# EAGLE design Aux_kicker (EAGLE 6.1)
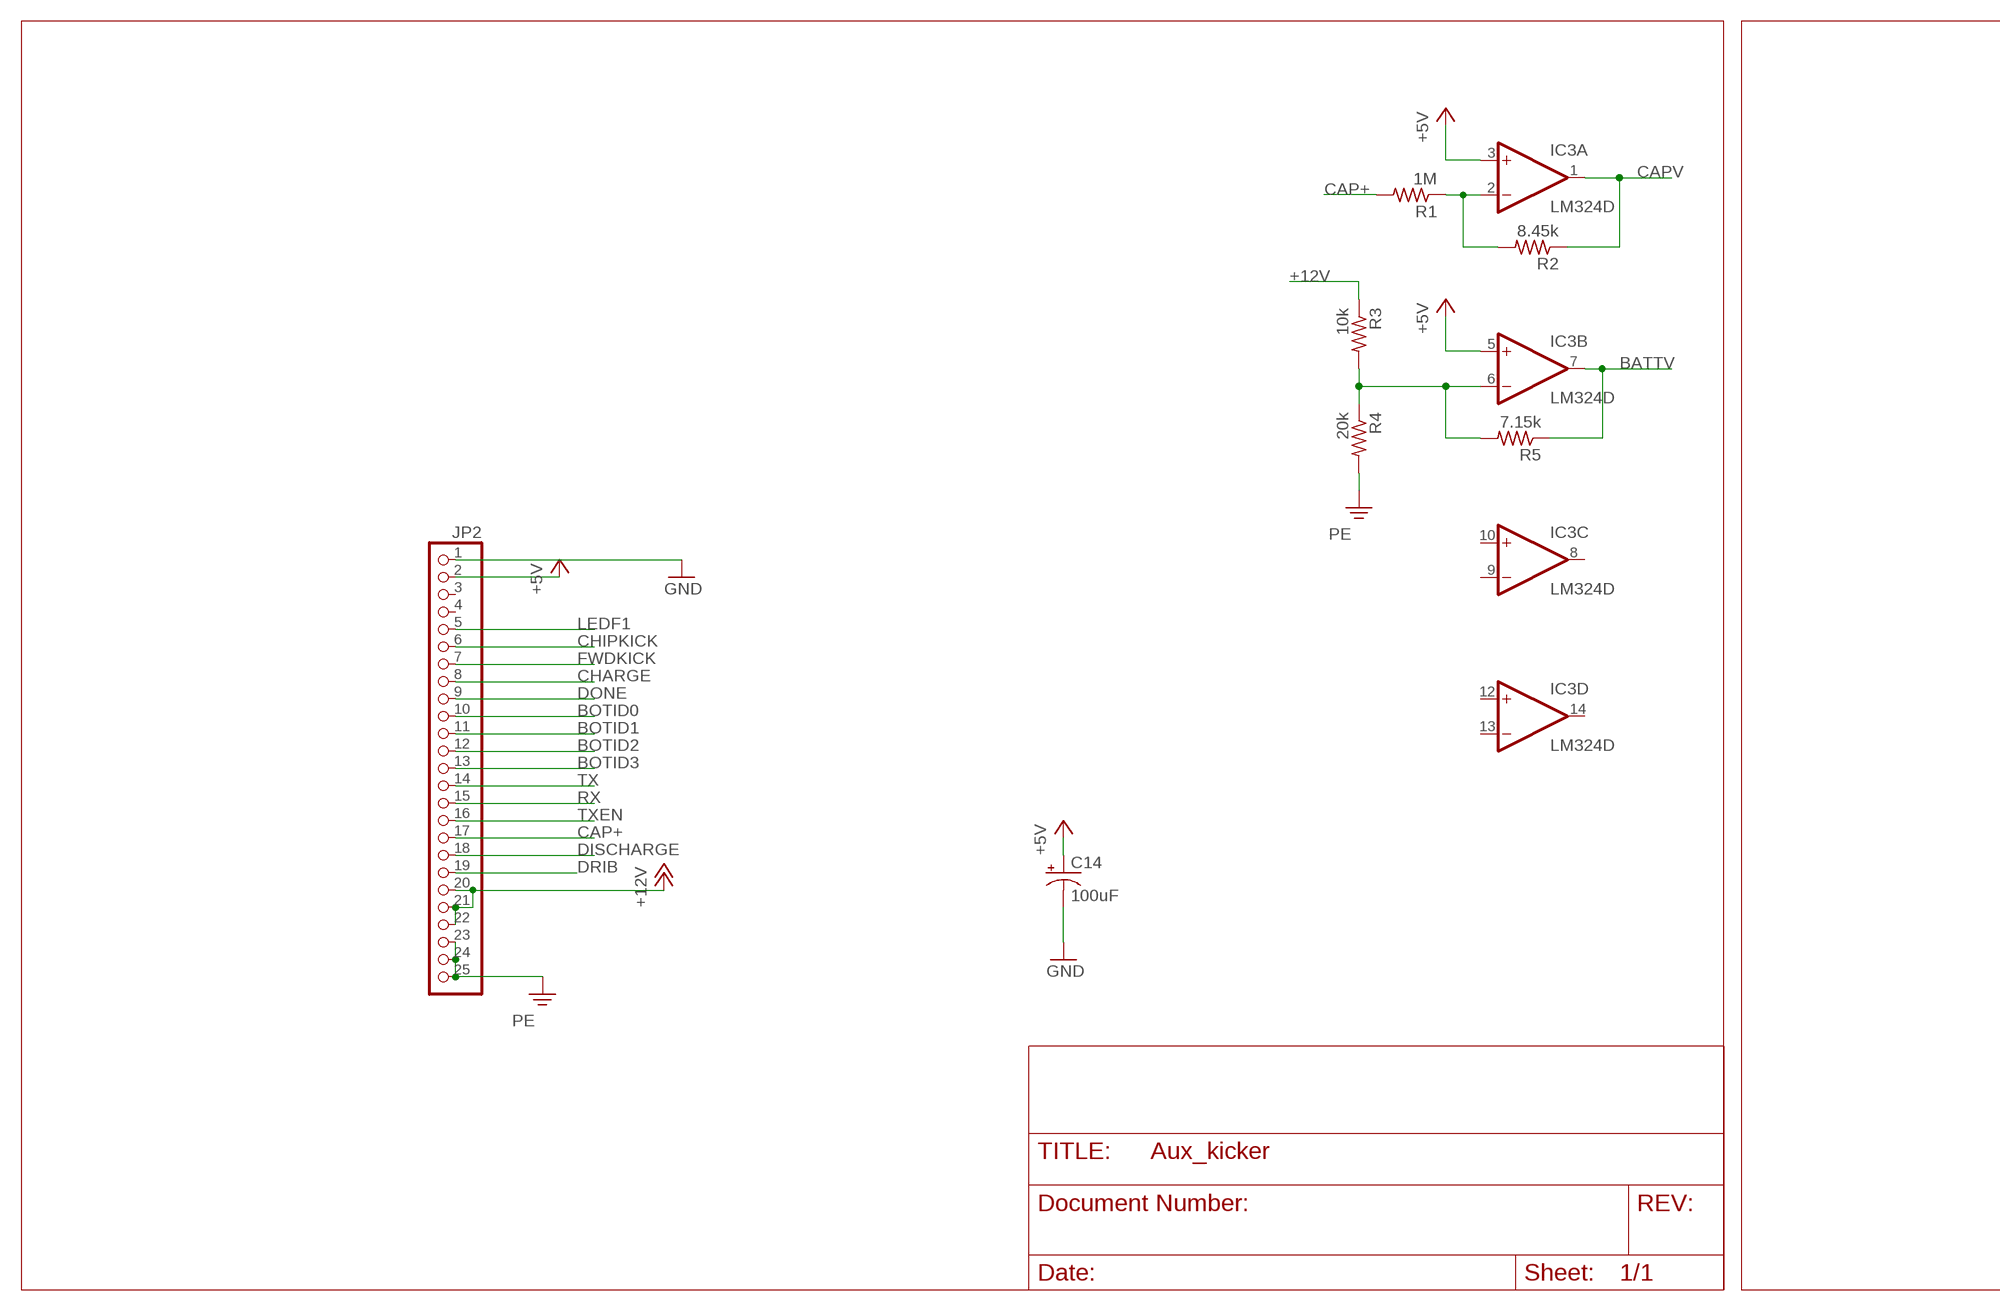
[diagram p0: schematic, sheet 1, part 1 of 2]
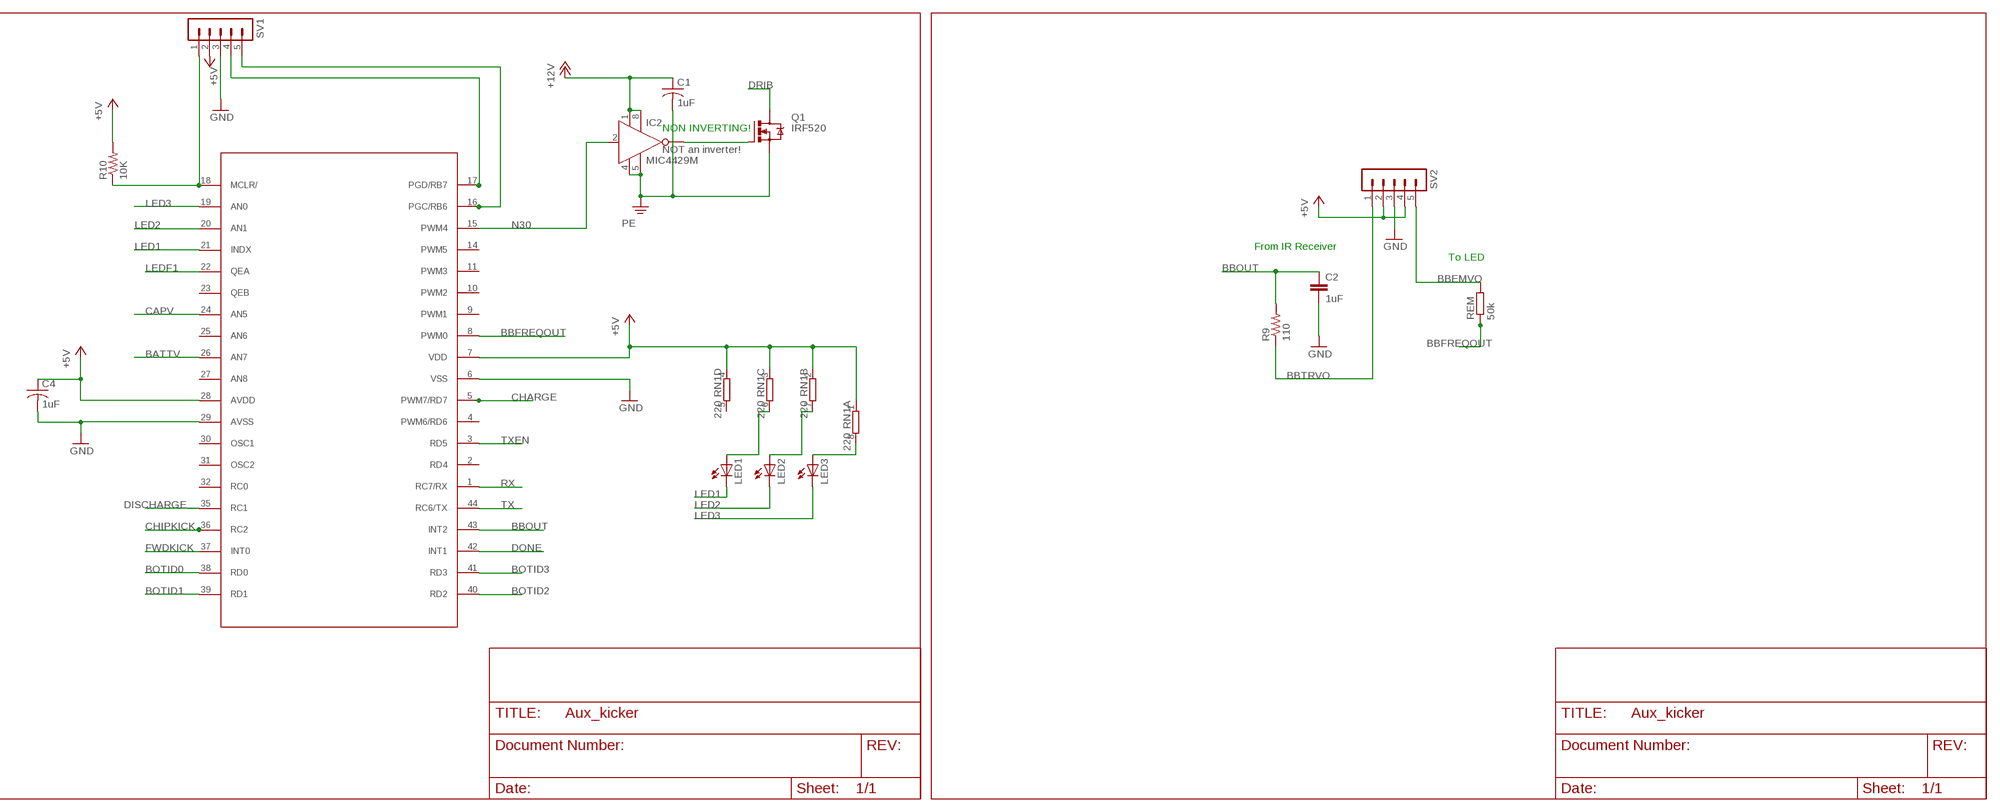
[diagram p1: schematic, sheet 1, part 2 of 2]

## Parts
C1  1uF  C-USC0805  [C0805]
C2  1uF  C-EUC0805  [C0805]
C4  1uF  C-USC0805  [C0805]
C14  100uF  CPOL-USE2.5-5  [E2,5-5]
IC1  PIC18F4431S  [TQFP44]
IC2  MIC4429M  [SO-08]
IC3  LM324D  [SO14]
JP2  PINHD-1X25  [1X25]
LED1  LEDCHIPLED_0805  [CHIPLED_0805]
LED2  LEDCHIPLED_0805  [CHIPLED_0805]
LED3  LEDCHIPLED_0805  [CHIPLED_0805]
Q1  IRF520  [TO220BV]
R1  1M  R-US_R0805  [R0805]
R2  8.45k  R-US_R0805  [R0805]
R3  10k  R-US_R0805  [R0805]
R4  20k  R-US_R0805  [R0805]
R5  7.15k  R-US_R0805  [R0805]
R9  110  R-US_R0805  [R0805]
R10  10K  R-US_R0805  [R0805]
REM  50k  R-EU_R0805  [R0805]
RN1  220  4R-N0603-ARC  [0603-ARC]
SV1  MA05-1  [MA05-1]
SV2  MA05-1  [MA05-1]

## Nets
+5V: C4.1 C14.+ IC1.7(VDD) IC1.28(AVDD) IC3.3(A:+IN) IC3.5(B:+IN) JP2.2 R10.2 RN1.1 RN1.2 RN1.3 RN1.4 SV1.2 SV2.2 SV2.4
+12V: C1.1 IC2.1(VS) IC2.8(VS1) JP2.20 JP2.21 JP2.22 R3.1
BATTV: IC1.26(AN7) IC3.7(B:OUT) R5.1
BBEMVO: REM.2 SV2.5
BBFREQOUT: IC1.8(PWM0) REM.1
BBOUT: C2.1 IC1.43(INT2) R9.2
BBTRVO: R9.1 SV2.1
BOTID0: IC1.38(RD0) JP2.10
BOTID1: IC1.39(RD1) JP2.11
BOTID2: IC1.40(RD2) JP2.12
BOTID3: IC1.41(RD3) JP2.13
CAP+: JP2.17 R1.2
CAPV: IC1.24(AN5) IC3.1(A:OUT) R2.1
CHARGE: IC1.5(PWM7/RD7) JP2.8
CHIPKICK: IC1.36(RC2) JP2.6
DISCHARGE: IC1.35(RC1) JP2.18
DONE: IC1.42(INT1) JP2.9
DRIB: JP2.19 Q1.D
FWDKICK: IC1.37(INT0) JP2.7
GND: C2.2 C4.2 C14.- IC1.6(VSS) IC1.29(AVSS) JP2.1 SV1.3 SV2.3
LED1: IC1.21(INDX) LED1.C
LED2: IC1.20(AN1) LED2.C
LED3: IC1.19(AN0) LED3.C
LEDF1: IC1.22(QEA) JP2.5
N30: IC1.15(PWM4) IC2.2(IN)
N$1: LED3.A RN1.8
N$2: LED2.A RN1.7
N$3: LED1.A RN1.6
N$4: IC3.2(A:-IN) R1.1 R2.2
N$5: IC2.6(OUT) Q1.G
N$7: IC3.6(B:-IN) R3.2 R4.1 R5.2
N$9: IC1.18(MCLR/) R10.1 SV1.1
N$22: IC1.17(PGD/RB7) SV1.4
N$23: IC1.16(PGC/RB6) SV1.5
PE: C1.2 IC2.4(GND) IC2.5(GND1) JP2.23 JP2.24 JP2.25 Q1.S R4.2
RX: IC1.1(RC7/RX) JP2.15
TX: IC1.44(RC6/TX) JP2.14
TXEN: IC1.3(RD5) JP2.16
Unconnected: IC1.2(RD4) IC1.4(PWM6/RD6) IC1.9(PWM1) IC1.10(PWM2) IC1.11(PWM3) IC1.14(PWM5) IC1.23(QEB) IC1.25(AN6) IC1.27(AN8) IC1.30(OSC1) IC1.31(OSC2) IC1.32(RC0) IC2.7(OUT) IC3.8(C:OUT) IC3.9(C:-IN) IC3.10(C:+IN) IC3.12(D:+IN) IC3.13(D:-IN) IC3.14(D:OUT) JP2.3 JP2.4 RN1.5

## Notes on the sheet
- NON INVERTING!
- NOT an inverter!
- From IR Receiver
- To LED

## Power pins joined to a net without a drawn wire
V+: IC3.4(P:V+)
V-: IC3.11(P:V-)

## Library data of the parts
C1 C4 = rcl:C-US: CAPACITOR, American symbol
C2 = rcl:C-EU: CAPACITOR, European symbol
C14 = rcl:CPOL-US: POLARIZED CAPACITOR, American symbol
IC1 = microchip:PIC18F4431
IC2 = transistor-power:MIC4429: 6A-Peak Low-Side MOSFET Driver (INVERTED) Bipolar/CMOS/DMOS Process http://www.micrel.com/_PDF/mic4420.pdf
IC3 = linear:LM324: OP AMP
JP2 = pinhead:PINHD-1X25: PIN HEADER
LED1-LED3 = led:LED: LED OSRAM: - CHIPLED LG R971, LG N971, LY N971, LG Q971, LY Q971, LO R971, LY R971 LH N974, LH R974 LS Q976, LO Q976, LY Q976 LO Q996 - Hyper CHIPLED LW Q18S LB Q993, LB Q99A, LB R99A - SideLED LS A670, LO A670, LY A670, LG A670, LP A670 LB A673, LV A673, LT A673, LW A673 LH A674 LY A675 LS A676, LA A676, LO A676, LY A676, LW A676 LS A679, LY A679, LG A679 - Hyper Micro SIDELED® LS Y876, LA Y876, LO Y876, LY Y876 LT Y87S - SmartLED LW L88C, LW L88S LB L89C, LB L89S, LG L890 LS L89K, LO L89K, LY L89K LS L896, LA L896, LO L896, LY L896 - TOPLED LS T670, LO T670, LY T670, LG T670, LP T670 LSG T670, LSP T670, LSY T670, LOP T670, LYG T670 LG T671, LOG T671, LSG T671 LB T673, LV T673, LT T673, LW T673 LH T674 LS T676, LA T676, LO T676, LY T676, LB T676, LH T676, LSB T676, LW T676 LB T67C, LV T67C, LT T67C, LS T67K, LO T67K, LY T67K, LW E67C LS E67B, LA E67B, LO E67B, LY E67B, LB E67C, LV E67C, LT E67C LW T67C LS T679, LY T679, LG T679 LS T770, LO T770, LY T770, LG T770, LP T770 LB T773, LV T773, LT T773, LW T773 LH T774 LS E675, LA E675, LY E675, LS T675 LS T776, LA T776, LO T776, LY T776, LB T776 LHGB T686 LT T68C, LB T68C - Hyper Mini TOPLED® LB M676 - Mini TOPLED Santana® LG M470 LS M47K, LO M47K, LY M47K Source: http://www.osram.convergy.de LUXEON: - LUMILED® LXK2-PW12-R00, LXK2-PW12-S00, LXK2-PW14-U00, LXK2-PW14-V00 LXK2-PM12-R00, LXK2-PM12-S00, LXK2-PM14-U00 LXK2-PE12-Q00, LXK2-PE12-R00, LXK2-PE12-S00, LXK2-PE14-T00, LXK2-PE14-U00 LXK2-PB12-K00, LXK2-PB12-L00, LXK2-PB12-M00, LXK2-PB14-N00, LXK2-PB14-P00, LXK2-PB14-Q00 LXK2-PR12-L00, LXK2-PR12-M00, LXK2-PR14-Q00, LXK2-PR14-R00 LXK2-PD12-Q00, LXK2-PD12-R00, LXK2-PD12-S00 LXK2-PH12-R00, LXK2-PH12-S00 LXK2-PL12-P00, LXK2-PL12-Q00, LXK2-PL12-R00 Source: www.luxeon.com KINGBRIGHT: KA-3528ASYC Source: www.kingbright.com
Q1 = transistor-power:IRF520: HEXFET Power MOSFET
R1-R5 R9 R10 = rcl:R-US_: RESISTOR, American symbol
REM = rcl:R-EU_: RESISTOR, European symbol
RN1 = resistor-dil:4R-N: Array Chip Resistor Source: RS Component / Phycomp
SV1 SV2 = con-lstb:MA05-1: PIN HEADER

## Board
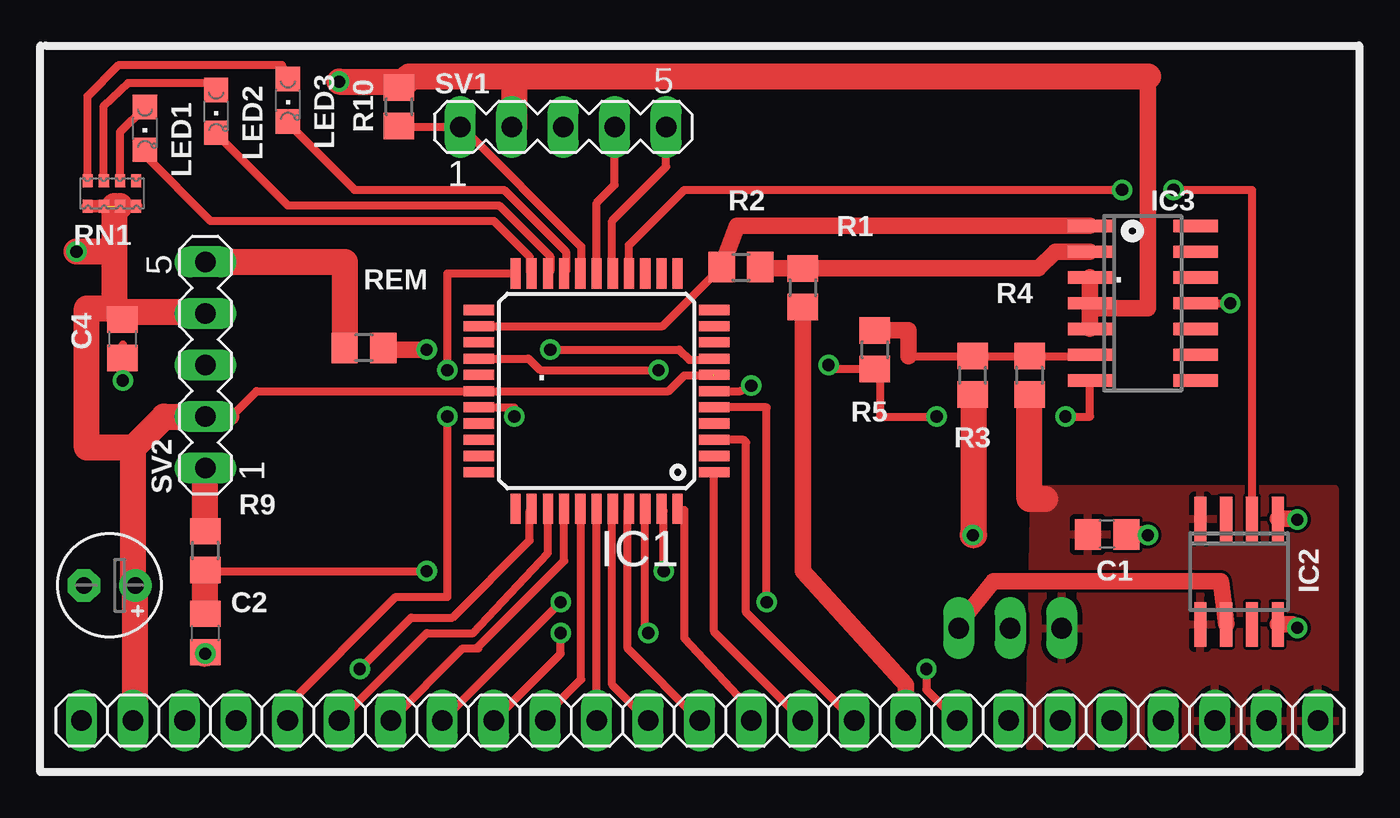
[diagram p2: board, top side]
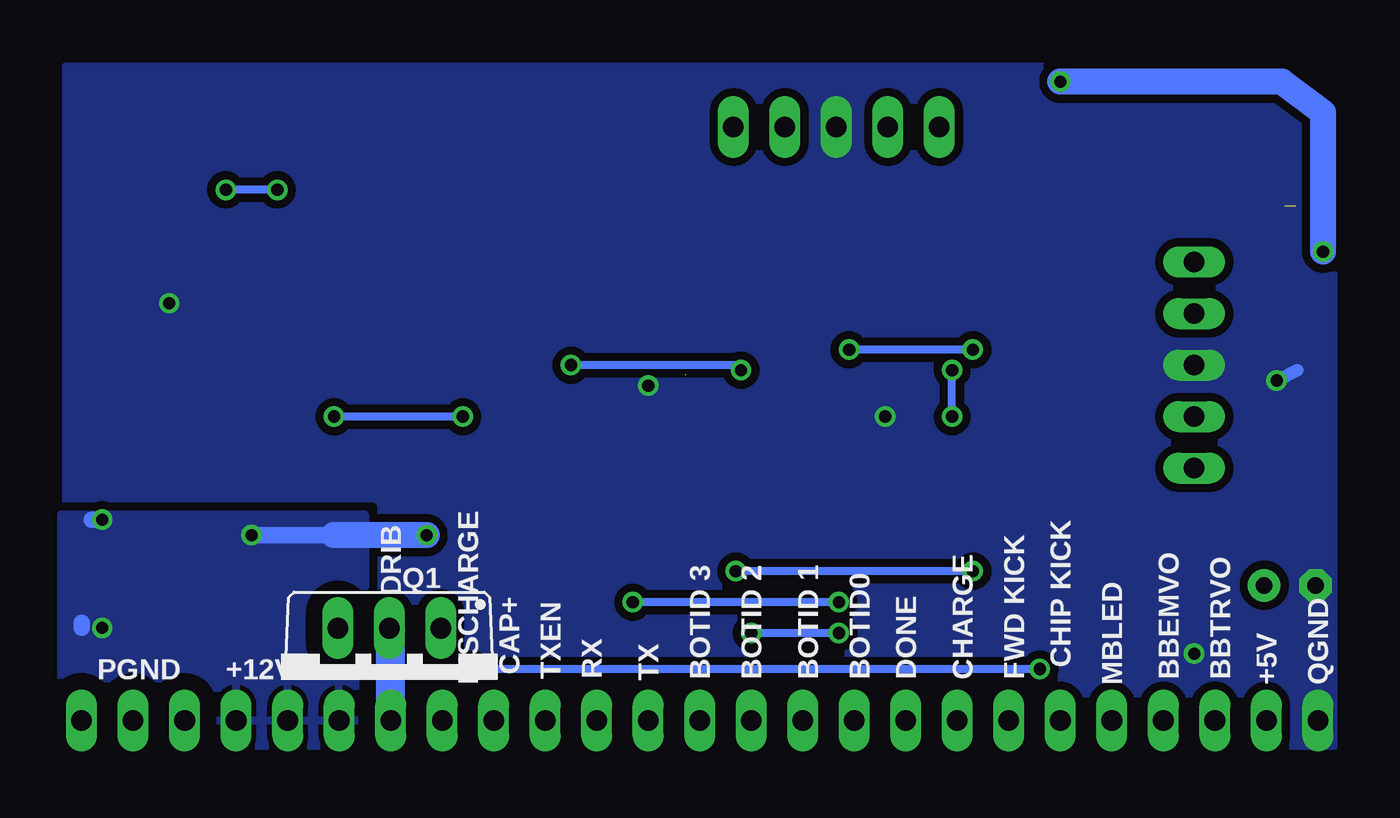
[diagram p3: board, bottom side, seen from below]

No outline drawn. Coordinates in mm, seen from the top.
Copper layers (1*16): Top 0.035mm / dielectric 1.5mm / Bottom 0.035mm
Design rules: minimum track width 10mil, minimum drill 24mil, track to track 6mil, track to pad 6mil, pad to pad 6mil, via to via 6mil, smd to smd 6mil, copper to edge 40mil, drill to drill 8mil, minimum pad ring 10mil, minimum via ring 8mil, stop-mask expansion 4mil, vias tented up to drill 0mil, thermal gap 10mil

### Footprints (pad centres in the part's own frame; a part is rotated, then mirrored left to right if it is on the bottom)
C0805 = smd 1.3 x 1.5: 1 -0.95,0; 2 0.95,0
E2,5-5 = drill 0.813 pad 1.6: + -1.27,0 | drill 0.813 pad 1.6 octagon: - 1.27,0
TQFP44@1 = smd 1.5 x 0.5: 1 -5.8,4; 2 -5.8,3.2; 3 -5.8,2.4; 4 -5.8,1.6; 5 -5.8,0.8; 6 -5.8,0; 7 -5.8,-0.8; 8 -5.8,-1.6; 9 -5.8,-2.4; 10 -5.8,-3.2; 11 -5.8,-4; 23 5.8,-4; 24 5.8,-3.2; 25 5.8,-2.4; 26 5.8,-1.6; 27 5.8,-0.8; 28 5.8,0; 29 5.8,0.8; 30 5.8,1.6; 31 5.8,2.4; 32 5.8,3.2; 33 5.8,4 | smd 0.5 x 1.5: 12 -4,-5.8; 13 -3.2,-5.8; 14 -2.4,-5.8; 15 -1.6,-5.8; 16 -0.8,-5.8; 17 0,-5.8; 18 0.8,-5.8; 19 1.6,-5.8; 20 2.4,-5.8; 21 3.2,-5.8; 22 4,-5.8; 34 4,5.8; 35 3.2,5.8; 36 2.4,5.8; 37 1.6,5.8; 38 0.8,5.8; 39 0,5.8; 40 -0.8,5.8; 41 -1.6,5.8; 42 -2.4,5.8; 43 -3.2,5.8; 44 -4,5.8
SO-08 = smd 0.6 x 2.2: 1 -1.905,-2.6; 2 -0.635,-2.6; 3 0.635,-2.6; 4 1.905,-2.6; 5 1.905,2.6; 6 0.635,2.6; 7 -0.635,2.6; 8 -1.905,2.6
SO14 = smd 0.6 x 2.2: 1 -3.81,-2.6; 2 -2.54,-2.6; 3 -1.27,-2.6; 4 0,-2.6; 5 1.27,-2.6; 6 2.54,-2.6; 7 3.81,-2.6; 8 3.81,2.6; 9 2.54,2.6; 10 1.27,2.6; 11 0,2.6; 12 -1.27,2.6; 13 -2.54,2.6; 14 -3.81,2.6
1X25 = drill 1.016 long: 1 -29.21,0; 2 -26.67,0; 3 -24.13,0; 4 -21.59,0; 5 -19.05,0; 6 -16.51,0; 7 -13.97,0; 8 -11.43,0; 9 -8.89,0; 10 -6.35,0; 11 -3.81,0; 12 -1.27,0; 13 1.27,0; 14 3.81,0; 15 6.35,0; 16 8.89,0; 17 11.43,0; 18 13.97,0; 19 16.51,0; 20 19.05,0; 21 21.59,0; 22 24.13,0; 23 26.67,0; 24 29.21,0; 25 31.75,0
CHIPLED_0805 = smd 1.2 x 1.2: A 0,-1.05; C 0,1.05
TO220BV = drill 1.016 long: D 0,-2.54; G -2.54,-2.54; S 2.54,-2.54
R0805 = smd 1.3 x 1.5: 1 -0.95,0; 2 0.95,0
0603-ARC = smd 0.5 x 0.65: 1 -1.2,-0.625; 2 -0.4,-0.625; 3 0.4,-0.625; 4 1.2,-0.625; 5 1.2,0.625; 6 0.4,0.625; 7 -0.4,0.625; 8 -1.2,0.625
MA05-1 = drill 1.016 long: 1 -5.08,0; 2 -2.54,0; 3 0,0; 4 2.54,0; 5 5.08,0

### Placement (x,y rotation side)
C1  52.6,11.72 180 top
C2  8.13,6.86 270 top
C4  4.04,21.37 270 top
C14  3.41,9.21 180 top
IC1  [TQFP44@1]  27.42,18.78 180 top
IC2  59.1,9.88 180 top
IC3  54.36,23.11 270 top
JP2  31.24,2.54 0 top
LED1  5.16,31.73 180 top
LED2  8.67,32.57 180 top
LED3  12.21,33.12 180 top
Q1  47.82,4.56 180 bottom
R1  37.59,23.88 270 top
R2  34.54,24.89 0 top
R3  45.97,19.56 90 top
R4  48.77,19.56 270 top
R5  41.15,20.83 90 top
R9  8.13,10.92 270 top
R10  17.68,32.8 90 top
REM  15.95,20.92 180 top
RN1  3.53,28.53 0 top
SV1  25.78,31.8 0 top
SV2  8.13,20.07 90 top

### Tracks (layer width: path | path; a pad name or v marks a point on that pad's centre or on a via)
+5V  (via drill 0.6)  (2 unrouted)
  Top 0.406: R10.2 18.19,33.69 | 9.4,17.53 10.65,18.78 IC1.28 30.97,18.78 31.75,19.56 33.2,19.56
  Top 0.61: 3.65,27.9 RN1.1 | RN1.3 RN1.4 | R10.2 18.03,33.53 18.03,34.04
  Top 0.813: SV2.2 9.4,17.53 | 51.76,22.86 IC3.5 | 51.76,22.86 IC3.3 | 51.76,22.86 54.61,22.86 54.61,34.29
  Top 1.27: JP2.2 4.68,2.54 C14.+ 4.57,9.21 4.57,16 | 3.65,22.7 C4.1 | RN1.3 3.65,27.9 3.65,25.65 | 3.65,22.86 3.65,25.65 | 3.65,25.65 v1.78,25.65 | 4.57,16 2.29,16 2.29,22.86 3.65,22.86 | 3.65,22.86 3.65,22.7 | 4.57,16 6.1,17.53 SV2.2 | SV2.4 8.03,22.7 3.65,22.7 | v14.73,34.04 18.03,34.04 | R10.2 18.19,34.29 23.37,34.29 | 23.37,34.29 23.37,31.8 SV1.2 | 23.37,34.29 54.61,34.29
  Bottom 1.27: v1.78,25.65 1.78,32.51 3.81,34.04 v14.73,34.04
+12V  (via drill 0.6)
  Top 0.813: IC2.8 61.72,7.28 v61.98,7.11 | IC2.1 61.98,12.48 v61.98,12.45 | C1.1 54.57,11.72 v54.61,11.68
  Top 1.27: R3.1 46.04,18.54 46.04,11.68 v45.97,11.68
  Bottom 0.813: 62.99,7.37 62.99,7.11 | v61.98,12.45 62.48,12.45 | 50.55,11.68 v54.61,11.68
  Bottom 1.27: v45.97,11.68 50.55,11.68
  pour Bottom (isolate 0.813): 49.02,1.27 64.01,1.27 64.01,12.7 49.02,12.7
BATTV  (via drill 0.6)
  Top 0.406: IC1.26 24.07,20.38 24.64,19.81 v30.48,19.81 | v44.2,17.53 41.4,17.53 41.4,19.56 R5.1 38.86,19.88 v38.86,20.07 | v50.55,17.53 51.76,17.53 IC3.7
  Bottom 0.406: v44.2,17.53 v50.55,17.53 | v30.48,19.81 30.48,20.07 v38.86,20.07
BBEMVO
  Top 1.27: SV2.5 15,25.15 REM.2
BBFREQOUT  (via drill 0.6)
  Top 0.406: v25.15,20.83 31.5,20.83 32,20.32 33.16,20.32 IC1.8
  Top 0.813: REM.1 16.9,20.83 v19.05,20.83
  Bottom 0.406: v19.05,20.83 v25.15,20.83
BBOUT  (via drill 0.6)
  Top 0.406: v30.73,9.91 30.73,12.87 IC1.43 | v19.05,9.91 8.13,9.91 8.13,9.4
  Top 1.27: C2.1 8.13,9.4 R9.2
  Bottom 0.406: v19.05,9.91 v30.73,9.91
BBTRVO
  Top 1.27: R9.1 SV2.1
BOTID0
  Top 0.406: JP2.10 24.89,2.79 26.67,4.57 26.67,12.94 IC1.38
BOTID1
  Top 0.406: JP2.11 27.43,12.97 IC1.39
BOTID2
  Top 0.406: 30,2.54 JP2.12 28.19,4.32 28.19,12.95 IC1.40
BOTID3
  Top 0.406: JP2.13 28.96,6.1 28.96,12.91 IC1.41
CAP+
  Top 0.813: JP2.17 42.67,4.32 37.59,9.91 R1.2
CAPV
  Top 0.406: R2.1 30.68,21.98 IC1.24
  Top 0.813: R2.1 34.36,26.92 IC3.1
CHARGE  (via drill 0.6)
  Top 0.406: v35.81,8.38 35.81,17.98 IC1.5 | JP2.8 v25.65,8.38
  Bottom 0.406: v25.65,8.38 v35.81,8.38
CHIPKICK
  Top 0.406: IC1.36 25.02,10.8 21.34,6.86 19.05,6.86 JP2.6
DISCHARGE  (via drill 0.6)
  Top 0.406: JP2.18 43.69,4.06 v43.69,5.08 | v15.75,5.08 18.29,7.62 20.32,7.62 24.13,11.43 24.13,12.89 IC1.35
  Bottom 0.406: v15.75,5.08 v43.69,5.08
DONE  (via drill 0.6)
  Top 0.406: JP2.9 25.65,5.84 v25.65,6.86 | v29.97,6.86 29.82,6.96 IC1.42
  Bottom 0.406: v25.65,6.86 v29.97,6.86
DRIB
  Bottom 1.422: JP2.19 47.75,7.02 Q1.D
FWDKICK
  Top 0.406: IC1.37 25.82,10.41 21.59,6.18 21.59,6.1 20.83,6.1 JP2.7
GND  (via drill 0.6)
  Top 0.406: 4.06,20.42 4.06,21.08 | IC1.6 34.53,18.78 v35.05,19.05 | IC1.29 23.37,17.98 v23.37,17.53 | 57.15,23.11 v58.67,23.11
  Top 0.61: v4.06,19.3 4.06,19.65 C4.2 4.06,20.42
  Top 1.27: C2.2 8.06,5.84 v8.13,5.84
  Bottom 0.61: v4.06,19.3 3.05,19.81
  pour Bottom (isolate 0.406, rank 3, no thermals): 1.27,1.27 63.75,1.27 63.75,34.8 1.27,34.8
LED1
  Top 0.406: LED1.C 5.16,30.4 8.38,27.18 22.35,27.18 24.13,25.4 24.13,24.68 IC1.21
LED2
  Top 0.406: LED2.C 8.67,31.46 12.19,27.94 22.61,27.94 25.15,25.4 25.15,24.7 IC1.20
LED3
  Top 0.406: LED3.C 12.21,31.99 15.49,28.7 22.86,28.7 25.91,25.65 25.91,24.67 IC1.19
LEDF1  (via drill 0.6)
  Top 0.406: 23.37,24.53 IC1.22 20.07,24.58 v20.07,19.81 | JP2.5 12.19,3.3 17.53,8.64 20.07,8.64 v20.07,17.53
  Bottom 0.406: v20.07,17.53 v20.07,19.81
N30  (via drill 0.6)
  Top 0.406: IC1.15 29.02,25.98 31.75,28.7 v53.34,28.7 | v55.88,28.7 59.74,28.7 IC2.2
  Bottom 0.406: v53.34,28.7 v55.88,28.7
N$1
  Top 0.406: RN1.8 2.33,33.32 3.87,34.86 11.9,34.86 LED3.A
N$2
  Top 0.406: RN1.7 3.13,32.85 4.32,33.97 8.51,33.97 LED2.A
N$3
  Top 0.406: RN1.6 3.93,31.56 LED1.A
N$4
  Top 0.813: R2.2 35.31,24.83 R1.1 49.21,24.83 50.04,25.65 IC3.2
N$5
  Top 0.813: Q1.G 45.28,7.29 46.99,9.4 58.21,9.4 IC2.6
N$7
  Top 0.406: 42.79,20.51 R3.2 R4.1 51.69,20.51 IC3.6
  Top 0.813: R5.2 42.79,21.78 42.79,20.51
N$9
  Top 0.406: IC1.18 26.67,24.63 26.67,25.91 20.78,31.8 SV1.1 17.68,31.8 R10.1
N$22
  Top 0.406: IC1.17 27.43,24.59 27.43,28.07 28.32,28.95 SV1.4
N$23
  Top 0.406: IC1.16 28.19,24.61 28.19,27.18 30.86,29.84 SV1.5
PE
  Top 1.27: R4.2 48.77,13.46 49.53,13.46
  pour Top: 63.82,1.27 48.77,1.27 49.02,13.97 63.82,13.97
RX
  Top 0.406: JP2.15 33.22,6.91 IC1.1
TX
  Top 0.406: JP2.14 35.05,3.05 31.75,6.6 31.75,12.91 IC1.44
TXEN
  Top 0.406: JP2.16 34.8,7.87 34.8,16.26 34.67,16.38 IC1.3

### Text on the board
tPlace: . | .
bNames: CHIP KICK | DRIB | MBLED | RX | TX | BBTRVO | BBEMVO | FWD KICK | CHARGE | DONE | BOTID0 | BOTID 1 | BOTID 2 | BOTID 3 | TXEN | CAP+ | +12V | PGND | QGND | +5V | DISCHARGE
tDocu: Rev. 4